# Altium schematic sheet Power.SchDoc
size A4
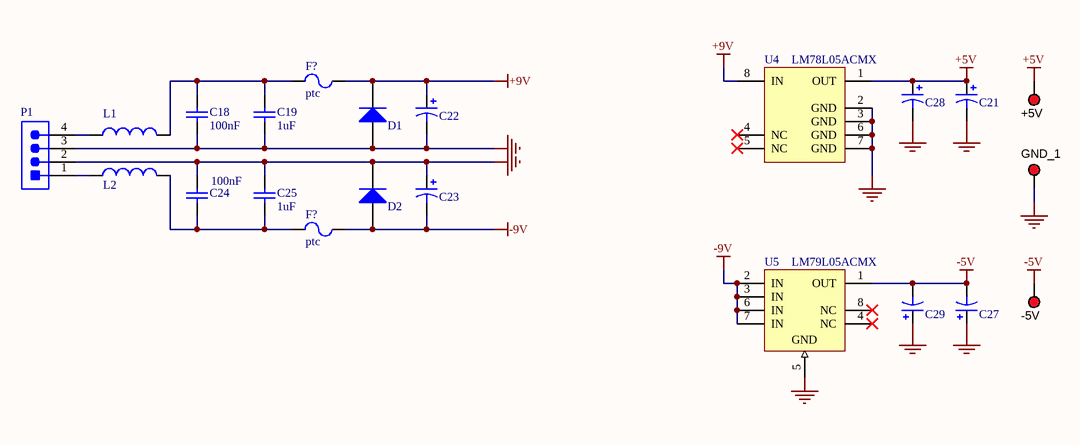
[diagram p0: Power.SchDoc]

## Parts
(Parts that share a designator on the sheet are numbered #1, #2 ... from top to bottom, then left to right.)
+5V  5010  [KSTN-5010_V]  (value not drawn)
-5V  5010  [KSTN-5010_V]  (value not drawn)
C18  100nF  [CAPC0603(1608)100_N]
C19  1uF  [CAPC0603(1608)100_N]
C21  ECA-1HM470  [PNSC-ECA-1HM470]  (value not drawn)
C22  ECA-1HM470  [PNSC-ECA-1HM470]  (value not drawn)
C23  ECA-1HM470  [PNSC-ECA-1HM470]  (value not drawn)
C24  100nF  [CAPC0603(1608)100_N]
C25  1uF  [CAPC0603(1608)100_N]
C27  ECA-1HM470  [PNSC-ECA-1HM470]  (value not drawn)
C28  ECA-1HM470  [PNSC-ECA-1HM470]  (value not drawn)
C29  ECA-1HM470  [PNSC-ECA-1HM470]  (value not drawn)
D1  MMSD4148T3G  [ONSC-SOD123-2-425G-04_V]  (value not drawn)
D2  MMSD4148T3G  [ONSC-SOD123-2-425G-04_V]  (value not drawn)
F?#1  ptc  [LFUS-1206L012WR_V]
F?#2  ptc  [LFUS-1206L012WR_V]
GND_1  5010  [KSTN-5010_V]  (value not drawn)
L1  FBMJ2125HM210NT  [INDC2013X105X50ML20T30]  (value not drawn)
L2  FBMJ2125HM210NT  [INDC2013X105X50ML20T30]  (value not drawn)
P1  22-27-2041  [MOLX-22-27-2041_V]  (value not drawn)
U4  LM78L05ACMX  [M08A_L]
U5  LM79L05ACMX  [D0008A_M]

## Nets
+5V: +5V.1 C21.1(+) C28.1(+) U4.1(OUT)
+9V: C22.1(+) D1.1(CATHODE) F?#1.2 U4.8(IN)
-5V: -5V.1 C27.2(-) C29.2(-) U5.1(OUT)
-9V: C23.2(-) D2.2(ANODE) F?#2.2 U5.2(IN) U5.3(IN) U5.6(IN) U5.7(IN)
GND: C18.1 C19.1 C21.2(-) C22.2(-) C23.1(+) C24.2 C25.2 C27.1(+) C28.2(-) C29.1(+) D1.2(ANODE) D2.1(CATHODE) GND_1.1 P1.2 P1.3 U4.2(GND) U4.3(GND) U4.6(GND) U4.7(GND) U5.5(GND)
NetC18_2: C18.2 C19.2 F?#1.1 L1.2
NetC24_1: C24.1 C25.1 F?#2.1 L2.2
NetL1_1: L1.1 P1.4
NetL2_1: L2.1 P1.1

Not connected (* = marked no-connect by the designer): U4 4(NC)* 5(NC)*; U5 4(NC)* 8(NC)*

## Library data of the parts
+5V -5V GND_1 = CMP-1672-00002-3: Test Point, Red, Through Hole, RoHS, Bulk; REACH SVHC: No SVHC; Contact Material: Bronze; PackageDescription: 1-Pin Through Hole Device, Dia 3.17 mm; Mounting Technology: Through Hole; Colour: Red; PackageReference: 5010; Height: 8.12 mm; Pins: 1; RoHSCompliant: true; Package Quantity: 100; Packaging: Bulk; Mount: Through Hole; DatasheetVersion: Rev. F, 12/2013; Contact Plating: Silver
C18 C24 = CMP-1035-02589-1: CAP 100nF 25V ±20% 0603 (1608 Metric) Thickness 1mm SMD; Case-EIA: 0603; Tolerance: Â±20%; Case-Metric: 1608; Value: 100nF; Max Thickness: 1 mm; Technology: SMT; Rated Voltage: 25 V
C19 C25 = CMP-1035-02589-1: CAP 1uF 25V ±20% 0603 (1608 Metric) Thickness 1mm SMD; Value: 100nF; Case-EIA: 0603; Tolerance: Â±20%; Case-Metric: 1608; Max Thickness: 1 mm; Technology: SMT; Rated Voltage: 25 V
C21-C23 C27-C29 = CMP-1665-00013-1: CAP ALUM 47UF 50V 20% RADIAL; PartNumber: ECA-1HM470; PackageReference: ECA-1HM470; ComponentLink1Description: Datasheet; ComponentLink1URL: http://industrial.panasonic.com/cdbs/www-data/pdf/RDF0000/ABA0000C1047.pdf
D1 D2 = CMP-0895-00002-1: Switching Diode, 100 V, 200 mA, -55 to 150 degC, 2-Pin SOD123 (425), RoHS, Tape and Reel; Manufacturer: ON Semiconductor; CD (Max): 4 pF; IR @ VR: 75 V (Max)=50 uA; PD (Max): 425 mW; VF (Max): 1 A; Trr (Max): 4 ns; VBR (Min): 100 V; ComponentLink1URL: http://www.onsemi.com/; ComponentLink1Description: Manufacturer URL; PackageReference: SOD123-2-425G-04; PackageDescription: 2-Pin SOD123, Body 2.69 x 1.6 mm, Height 1.35 mm; ComponentLink2Description: Datasheet; Mounting Technology: Surface Mount; RoHS: TRUE; PartNumber: MMSD4148T3G; PackageVersion: Rev. 04G; DatasheetVersion: Rev. 11; Temperature Range: -55 to 150 degC; ComponentLink3Description: Package Specification; Packing: Tape and Reel; ComponentLink3URL: http://www.onsemi.com/pub_link/Collateral/425-04.PDF; ComponentLink2URL: http://www.onsemi.com/pub_link/Collateral/MMSD4148T1-D.PDF
F?#1 F?#2 = CMP-2000-05470-1: 200mA PTC; Manufacturer: Littelfuse; Hold Current [Ih]: 0.125A; Working Voltage-Max: 30V; Trip Current: 0.29A; Operating Temp Range: -40to+85°C; Package Reference: 1206; Package Description: 2-Pin Surface Mount Device, Body 3.2 x 1.65 mm; Mounting Technology: SurfaceMount; Manufacturer URL: http://www.littelfuse.com/; Datasheet URL: https://datasheet.ciiva.com/26787/1206l012wr-26787215.pdf; Size: 1206; Datasheet Version: 04/2012
L1 L2 = CMP-1660-00003-1: Chip Inductor, 21 Ohm, +/- 30%, 6 A, -40 to 125 degC, 0805 (2012 Metric), RoHS, Tape and Reel; Core Material: Ferrite; Current Rating: 6 A; Resistance: 4 mohm; Case\Package: 0805; Impedance: 21 Ohm; Min Operating Temperature: -40 degC; Width: 1.25 mm; PackageDescription: 2-Pin Surface Mount Device, Body 2 x 1.25 mm; Mounting Technology: Surface Mount; Package Quantity: 1; DatasheetVersion: 08/2016; Tolerance: 30%; Mount: Surface Mount; Max Operating Temperature: 125 degC; Height: 0.85 mm; ComponentLink1URL: http://www.t-yuden.com/; Case Code (Metric): 2012; ComponentLink1Description: Manufacturer URL; ComponentLink2URL: http://ds.yuden.co.jp/TYCOMPAS/ut/detail.do?productNo=FBMJ2125HM210NT&fileName=FBMJ2125HM210NT_SS&mode=specSheetDownload; Case Code (Imperial): 0805; Packaging: Tape and Reel; ComponentLink2Description: Datasheet; PackageReference: 0805; RoHSCompliant: true; Max Current Rating: 6 A; Length: 2 mm; REACH SVHC: Unknown
P1 = CMP-2000-05243-1: Male Header, Pitch 2.54 mm, 1 x 4 Position, Height 11.7 mm, Tail Length 3.56 mm, RoHS, Bulk; Manufacturer: Molex; Voltage rating: 250V; Current rating: 4A; Datasheet Version: Rev. F, 06/2009; Operating temperature: 0degCto+75degC; Contact material: Tinplatedbrass; Manufacturer URL: http://www.molex.com/; Housing material: Nylon(UL94V-0); Datasheet URL: http://www.molex.com/pdm_docs/sd/022272041_sd.pdf
U4 = CMP-0062-01154-2: 3-Terminal Positive Regulators, 8-pin Narrow SOIC; Manufacturer: National Semiconductor; PackageTopMarking: NSZXTT*LM78L*05ACM; PowerWise: N; CompType: LDO IC; Code_JEDEC: MS-012-AA; PackageVersion: revM, May-2009; PackageDescription: SOIC Narrow, 4.9 x 3.9 x 1.45mm, 8 Lead, 1.27mm Pitch; ComponentLink2Description: LM78L05 Web Page; ComponentLink2URL: http://www.national.com/pf/LM/LM78L05.html; ComponentLink3Description: M08A Package Page; RevisionNote: Component URLs added; ComponentLink3URL: http://www.national.com/packaging/folders/m08a.html; ComponentLink1URL: http://www.national.com/ds/LM/LM78L05.pdf; ComponentLink1Description: LM78L05 Datasheet; PinCount: 8; DatasheetVersion: Apr-2006; Code_IPC: SOIC127P600-8; RoHS: N; PackageReference: M08A
U5 = CMP-0062-01120-3: Series 3-Terminal Negative Regulators, 8-pin Narrow SOIC; Manufacturer: Texas Instruments; CompType: LDO IC; PackageTopMarking: NSZXTT*LM79L*05ACM; PowerWise: N; PackageReference: D0008A; Code_JEDEC: MS-012-AA; PackageDescription: SOIC Narrow, 4.9 x 3.9 x 1.45mm, 8 Lead, 1.27mm Pitch; PinCount: 8; RoHS: N; Code_IPC: SOIC127P600-8; ComponentLink1Description: Datasheet URL; ComponentLink1URL: http://www.ti.com/general/docs/lit/getliterature.tsp?genericPartNumber=LM79L05&fileType=pdf